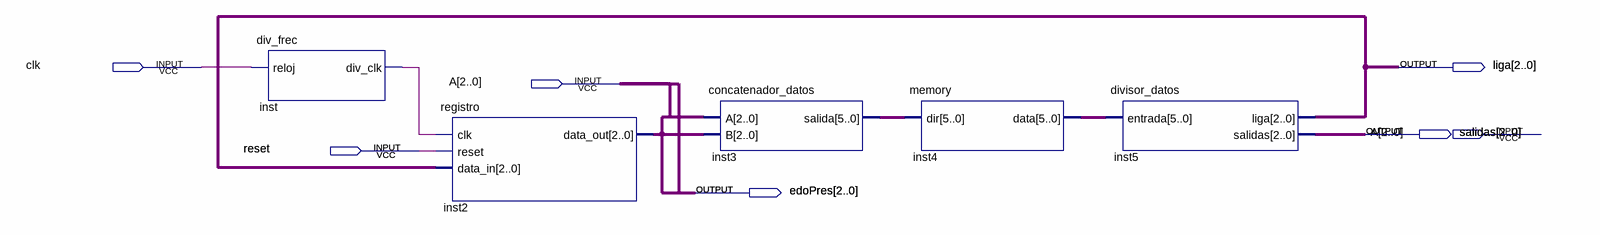
[diagram p0: schematic sheet]
// Quartus schematic practica3.bdf as structural Verilog: 5 symbols, 12 pins
module practica3 (
  input  clk,
  input  [2:0] A,
  inout  [2:0] salidas,
  input  reset,
  output [2:0] liga,
  output [2:0] edoPres
);

  wire inst_div_clk;
  wire [5:0] inst3_salida, inst4_data;

  div_frec inst (.reloj(clk), .div_clk(inst_div_clk));
  registro inst2 (.clk(inst_div_clk), .reset(reset), .data_in(liga), .data_out(A));
  concatenador_datos inst3 (.A(A), .B(A), .salida(inst3_salida));
  memory inst4 (.dir(inst3_salida), .data(inst4_data));
  divisor_datos inst5 (.entrada(inst4_data), .liga(liga), .salidas(salidas));

  assign edoPres = A;
endmodule
